# EAGLE design Yugocade (EAGLE 9.6.2)
COMPANY: ADAFRUIT INDUSTRIES; DRAWN: KTOWN; REV: B
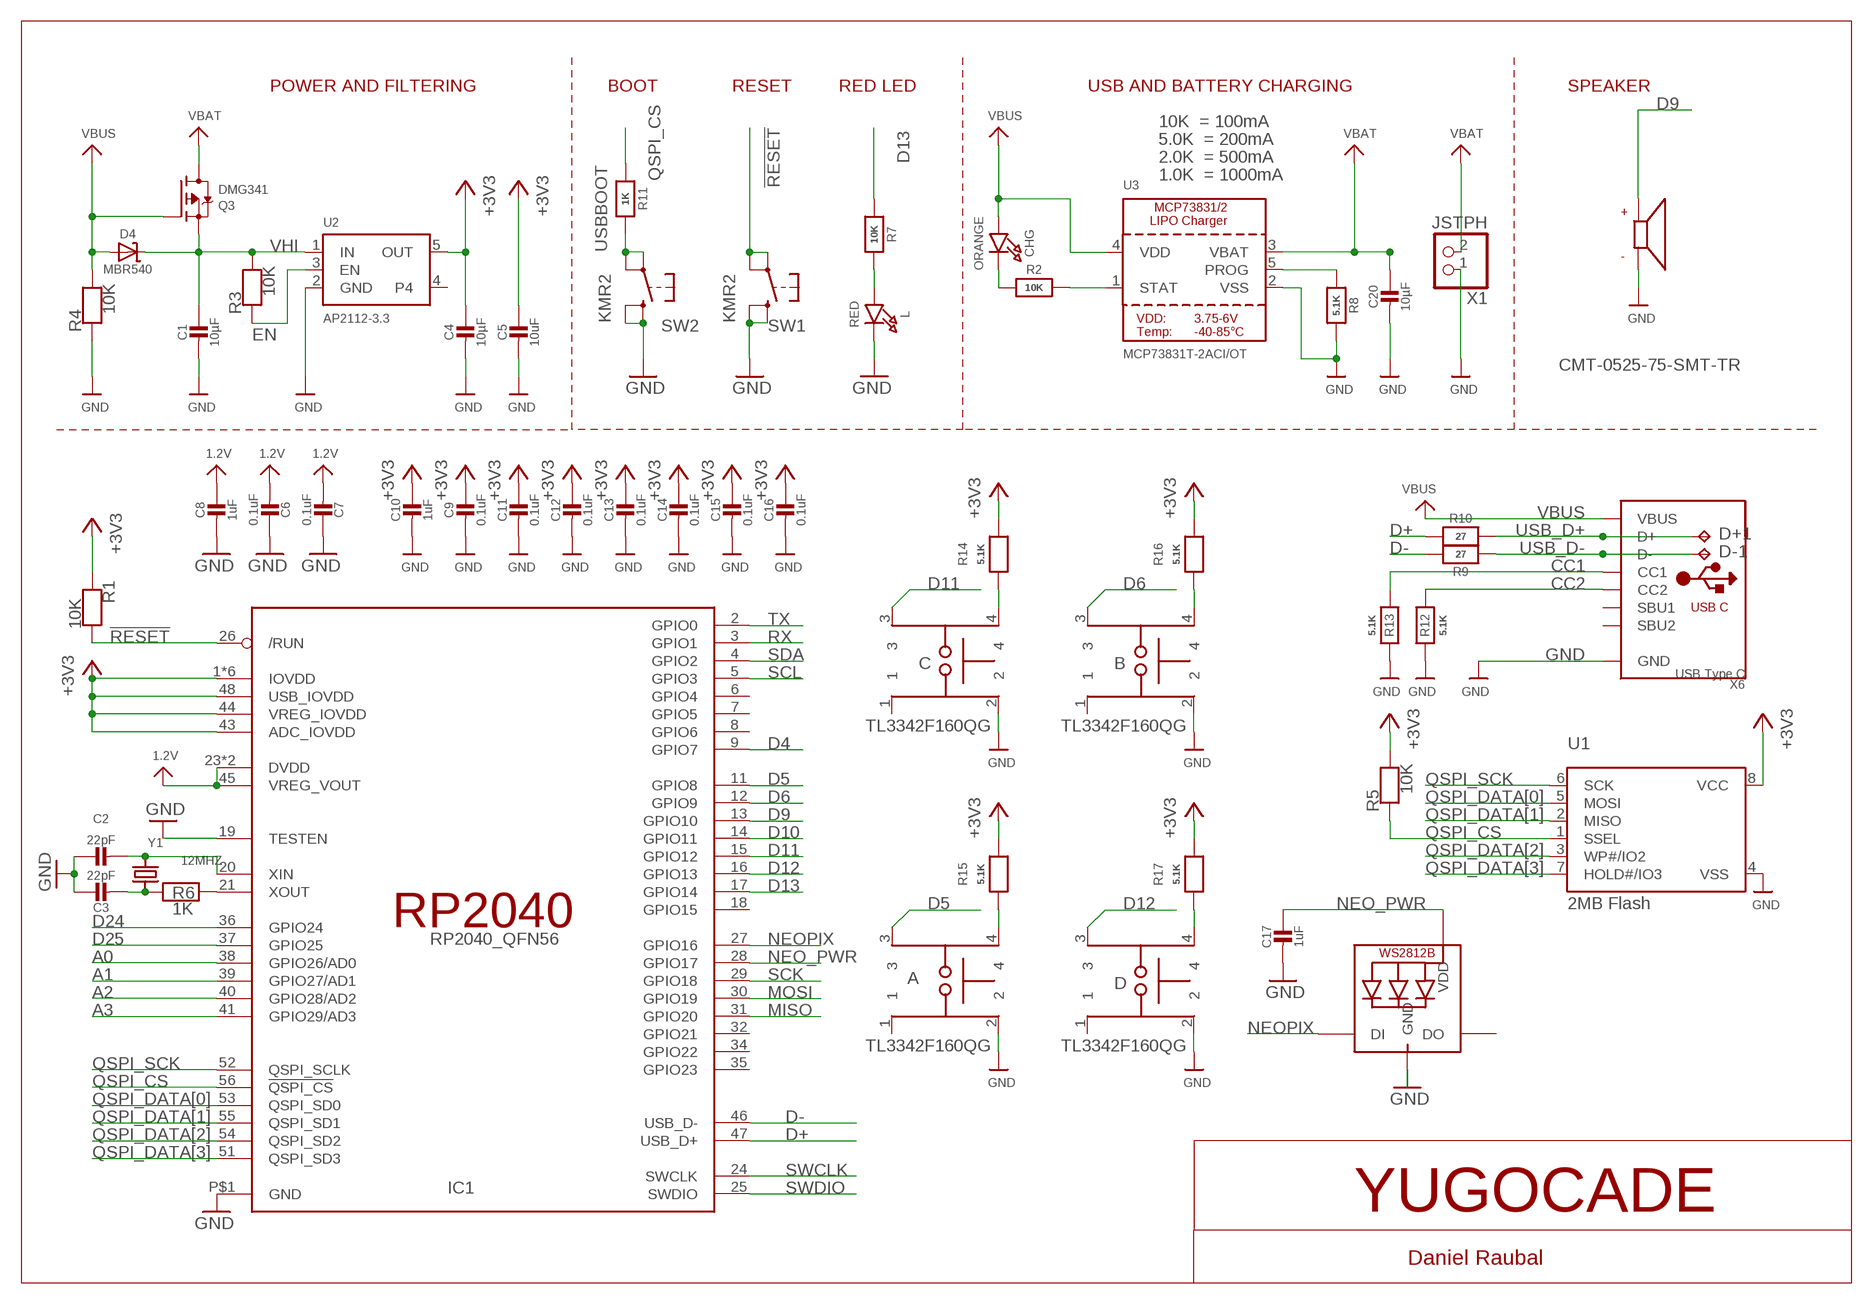
[diagram p0: schematic, sheet 1]

## Parts
A  TL3342F160QG  [SW_TL3342F160QG]
B  TL3342F160QG  [SW_TL3342F160QG]
C  TL3342F160QG  [SW_TL3342F160QG]
C1  10µF  CAP_CERAMIC0805-NOOUTLINE  [0805-NO]
C2  22pF  CAP_CERAMIC0603_NO  [0603-NO]
C3  22pF  CAP_CERAMIC0603_NO  [0603-NO]
C4  10µF  CAP_CERAMIC0805-NOOUTLINE  [0805-NO]
C5  10uF  CAP_CERAMIC0805-NOOUTLINE  [0805-NO]
C6  0.1uF  CAP_CERAMIC0603_NO  [0603-NO]
C7  0.1uF  CAP_CERAMIC0603_NO  [0603-NO]
C8  1uF  CAP_CERAMIC0603_NO  [0603-NO]
C9  0.1uF  CAP_CERAMIC0603_NO  [0603-NO]
C10  1uF  CAP_CERAMIC0603_NO  [0603-NO]
C11  0.1uF  CAP_CERAMIC0603_NO  [0603-NO]
C12  0.1uF  CAP_CERAMIC0603_NO  [0603-NO]
C13  0.1uF  CAP_CERAMIC0603_NO  [0603-NO]
C14  0.1uF  CAP_CERAMIC0603_NO  [0603-NO]
C15  0.1uF  CAP_CERAMIC0603_NO  [0603-NO]
C16  0.1uF  CAP_CERAMIC0603_NO  [0603-NO]
C17  1uF  CAP_CERAMIC0603_NO  [0603-NO]
C20  10µF  CAP_CERAMIC0805-NOOUTLINE  [0805-NO]
CHG  ORANGE  LED0603_NOOUTLINE  [CHIPLED_0603_NOOUTLINE]
D  TL3342F160QG  [SW_TL3342F160QG]
D4  MBR540  DIODE-SCHOTTKYSOD-123  [SOD-123]
D+1  TPB1,27  [B1,27]
D-1  TPB1,27  [B1,27]
IC1  RP2040_QFN56  [QFN56_7MM_REDUCEDEPAD]
L  RED  LED0603_NOOUTLINE  [CHIPLED_0603_NOOUTLINE]
LED1  WS2812B3535  [LED3535]
LS1  CMT-0525-75-SMT-TR  [XDCR_CMT-0525-75-SMT-TR]
Q3  DMG341  MOSFET-P  [SOT23-R]
R1  10K  RESISTOR_0603_NOOUT  [0603-NO]
R2  10K  RESISTOR_0603_NOOUT  [0603-NO]
R3  10K  RESISTOR_0603_NOOUT  [0603-NO]
R4  10K  RESISTOR_0603_NOOUT  [0603-NO]
R5  10K  RESISTOR_0603_NOOUT  [0603-NO]
R6  1K  RESISTOR_0603_NOOUT  [0603-NO]
R7  10K  RESISTOR_0603_NOOUT  [0603-NO]
R8  5.1K  RESISTOR_0603_NOOUT  [0603-NO]
R9  27  RESISTOR_0603_NOOUT  [0603-NO]
R10  27  RESISTOR_0603_NOOUT  [0603-NO]
R11  1K  RESISTOR_0603_NOOUT  [0603-NO]
R12  5.1K  RESISTOR_0603_NOOUT  [0603-NO]
R13  5.1K  RESISTOR_0603_NOOUT  [0603-NO]
R14  5.1K  RESISTOR_0603_NOOUT  [0603-NO]
R15  5.1K  RESISTOR_0603_NOOUT  [0603-NO]
R16  5.1K  RESISTOR_0603_NOOUT  [0603-NO]
R17  5.1K  RESISTOR_0603_NOOUT  [0603-NO]
SW1  KMR2  SWITCH_TACT_SMT4.6X2.8  [BTN_KMR2_4.6X2.8]
SW2  KMR2  SWITCH_TACT_SMT4.6X2.8  [BTN_KMR2_4.6X2.8]
U1  2MB Flash  SPIFLASH_8PIN208MIL  [SOIC8_208MIL]
U2  AP2112-3.3  VREG_SOT23-5  [SOT23-5@1]
U3  MCP73831T-2ACI/OT  MCP73831/2  [SOT23-5]
X1  JSTPH  CON_JST_PH_2PIN_BATT  [JSTPH2_BATT]
X6  USB Type C  USB_C  [USB_C_CUSB31-CFM2AX-01-X]
Y1  12MHZ  CRYSTAL2.5X2.0  [CRYSTAL_2.5X2]

## Nets
1.2V: C6.2 C7.2 C8.1 IC1.23(DVDD) IC1.45(VREG_VOUT) IC1.50(DVDD)
!RESET: IC1.26(/RUN) R1.2 SW1.A'(P1) SW1.A(P)
+3V3: C4.1 C5.1 C9.1 C10.1 C11.1 C12.1 C13.1 C14.1 C15.1 C16.1 IC1.1(IOVDD) IC1.10(IOVDD) IC1.22(IOVDD) IC1.33(IOVDD) IC1.42(IOVDD) IC1.43(ADC_IOVDD) IC1.44(VREG_IOVDD) IC1.48(USB_IOVDD) IC1.49(IOVDD) R1.1 R5.2 R14.1 R15.1 R16.1 R17.1 U1.8(VCC) U2.5(OUT)
A0: IC1.38(GPIO26/AD0)
A1: IC1.39(GPIO27/AD1)
A2: IC1.40(GPIO28/AD2)
A3: IC1.41(GPIO29/AD3)
CC1: R13.2 X6.A5(CC1)
CC2: R12.2 X6.B5(CC2)
D4: IC1.9(GPIO7)
D5: A.3 IC1.11(GPIO8)
D6: B.3 IC1.12(GPIO9)
D9: IC1.13(GPIO10) LS1.P
D10: IC1.14(GPIO11)
D11: C.3 IC1.15(GPIO12)
D12: D.3 IC1.16(GPIO13)
D13: IC1.17(GPIO14) R7.1
D24: IC1.36(GPIO24)
D25: IC1.37(GPIO25)
D+: IC1.47(USB_D+) R10.2
D-: IC1.46(USB_D-) R9.2
EN: R3.1 U2.3(EN)
GND [power]: A.2 B.2 C1.2 C2.1 C3.1 C4.2 C5.2 C6.1 C7.1 C8.2 C9.2 C10.2 C11.2 C12.2 C13.2 C14.2 C15.2 C16.2 C17.2 C20.2 C.2 D.2 IC1.19(TESTEN) IC1.P$1(GND) L.C LED1.4(GND) LS1.N R4.1 R8.2 R12.1 R13.1 SW1.B'(S1) SW1.B(S) SW2.B'(S1) SW2.B(S) U1.4(VSS) U2.2(GND) U3.2(VSS) X1.1 X6.A1B12(GND) X6.B1A12(GND)
MISO: IC1.31(GPIO20)
MOSI: IC1.30(GPIO19)
N$1: CHG.C R2.1
N$2: L.A R7.2
N$3: R2.2 U3.1(STAT)
N$4: R8.1 U3.5(PROG)
N$5: C2.2 IC1.20(XIN) Y1.3
N$6: C3.2 R6.1 Y1.1
N$7: IC1.21(XOUT) R6.2
N$8: C.4 R14.2
N$9: A.4 R15.2
N$10: B.4 R16.2
N$11: D.4 R17.2
NEO_PWR: C17.1 IC1.28(GPIO17) LED1.2(VDD)
NEOPIX: IC1.27(GPIO16) LED1.1(DI)
QSPI_CS: IC1.56(!QSPI_CS) R5.1 R11.1 U1.1(SSEL)
QSPI_DATA[0]: IC1.53(QSPI_SD0) U1.5(MOSI)
QSPI_DATA[1]: IC1.55(QSPI_SD1) U1.2(MISO)
QSPI_DATA[2]: IC1.54(QSPI_SD2) U1.3(WP#/IO2)
QSPI_DATA[3]: IC1.51(QSPI_SD3) U1.7(HOLD#/IO3)
QSPI_SCK: IC1.52(QSPI_SCLK) U1.6(SCK)
RX: IC1.3(GPIO1)
SCK: IC1.29(GPIO18)
SCL: IC1.5(GPIO3)
SDA: IC1.4(GPIO2)
SWCLK: IC1.24(SWCLK)
SWDIO: IC1.25(SWDIO)
TX: IC1.2(GPIO0)
USB_D+: D+1.TP R10.1 X6.A6(D+) X6.B6(D+)
USB_D-: D-1.TP R9.1 X6.A7(D-) X6.B7(D-)
USBBOOT: R11.2 SW2.A'(P1) SW2.A(P)
VBAT [power]: C20.1 Q3.3(D) U3.3(VBAT) X1.2
VBUS [power]: CHG.A D4.A Q3.1(G) R4.2 U3.4(VDD) X6.A4B9(VBUS) X6.B4A9(VBUS)
VHI [power]: C1.1 D4.C Q3.2(S) R3.2 U2.1(IN)
Unconnected: A.1 B.1 C.1 D.1 IC1.6(GPIO4) IC1.7(GPIO5) IC1.8(GPIO6) IC1.18(GPIO15) IC1.32(GPIO21) IC1.34(GPIO22) IC1.35(GPIO23) LED1.3(DO) U2.4 X6.A8(SBU1) X6.B8(SBU2)

## Notes on the sheet
- POWER AND FILTERING | BOOT | RESET | RED LED | USB AND BATTERY CHARGING | SPEAKER
- 10K  = 100mA
- 5.0K  = 200mA
- 2.0K  = 500mA
- 1.0K  = 1000mA
- YUGOCADE
- Daniel Raubal

## Library data of the parts
A B C D = TL3342F160QG:TL3342F160QG: TL3342 Series SPST 1.6 N Round Button Gull Wing Surface Mount Tactile Switch Check availability <https://pricing.snapeda.com/parts/TL3342F160QG/E-Switch/view-part?ref=eda>; AVAILABILITY: In Stock; DESCRIPTION: Tactile Switch SPST-NO Top Actuated Surface Mount; MF: E-Switch; MP: TL3342F160QG; PACKAGE: None; PRICE: None; PURCHASE-URL: https://pricing.snapeda.com/search/part/TL3342F160QG/?ref=eda
C1-C3 C5-C17 C20 = microbuilder:CAP_CERAMIC: Ceramic Capacitors For new designs, use the packages preceded by an '_' character since they are more reliable: The following footprints should be used on most boards: _0402 - Standard footprint for regular board layouts _0603 - Standard footprint for regular board layouts _0805 - Standard footprint for regular board layouts _1206 - Standard footprint for regular board layouts For extremely tight-pitch boards where space is at a premium, the following 'micro-pitch' footprints can be used (smaller pads, no silkscreen outline, etc.): _0402MP - Micro-pitch footprint for very dense/compact boards _0603MP - Micro-pitch footprint for very dense/compact boards _0805MP - Micro-pitch footprint for very dense/compact boards _1206MP - Micro-pitch footprint for very dense/compact boards
C4 = microbuilder:CAP_CERAMIC: Ceramic Capacitors For new designs, use the packages preceded by an '_' character since they are more reliable: The following footprints should be used on most boards: _0402 - Standard footprint for regular board layouts _0603 - Standard footprint for regular board layouts _0805 - Standard footprint for regular board layouts _1206 - Standard footprint for regular board layouts For extremely tight-pitch boards where space is at a premium, the following 'micro-pitch' footprints can be used (smaller pads, no silkscreen outline, etc.): _0402MP - Micro-pitch footprint for very dense/compact boards _0603MP - Micro-pitch footprint for very dense/compact boards _0805MP - Micro-pitch footprint for very dense/compact boards _1206MP - Micro-pitch footprint for very dense/compact boards; REV: A
CHG L = microbuilder:LED: LED 0603 - 0603 Surface Mount Package 2mA: Green LED - Low Power (3.9mcd, 2ma, 1.7Vf) - Digikey: 475-2709-2-ND Orange LED - Low Power (9.8mcd, 2ma, 1.8Vf) - Digikey: 475-1194-2-ND Red LED - Low Power (5mcd, 2ma, 1.8Vf) - Digikey: 475-1195-2-ND Yellow LED - Low Power (7mcd, 2ma, 1.8Vf) - Digikey: 475-1196-2-ND 5mA: Blue LED - Low Power (17mcd, 5ma, 2.9Vf) - Digikey: LNJ937W8CRACT-ND 0805 - 0805 Surface Mount Package 2mA: Red LED (8.8mcd, 2mA, 1.8Vf, Clear) - Low Power [Digikey: 475-2510-1-ND] Green LED (5mcd, 2mA, 1.8Vf, Clear) - Low Power [Digikey: 475-2730-1-ND] Yellow LED (11.3mcd, 2mA, 1.8Vf, Clear) - Low Power [Digikey: 475-2555-1-ND] 20mA: Red LED (104mcd, 20mA, Diffused) - LS R976 [Digikey: 475-1278-6-ND] Red LED (12mcd, 20mA, 2.0Vf, Clear) - APT2012EC [Digikey: 754-1128-1-ND] Green LED (15mcd, 20mA, 2.2Vf, Clear) - APT2012GC [Digikey: 754-1131-1-ND] Orange LED (160mcd, 20mA, 2.1Vf, Clear) - APT2012SECK [Digikey: 754-1130-1-ND] 1206 - 1206 Surface Mount Package Green LED (26mcd, 20mA, Diffused) - LG N971 [Digikey: 475-1407-6-ND] Red LED (15mcd, 20mA, Diffused) - LH N974 [Digikey: 475-1416-6-ND] Cree - Cree High-Power Surface Mount LEDs XPEBWT-L1-0000-00D50 - White 111lm 350mA 2.9Vf 6200K 110° XTEAWT-00-0000-00000LEE3 - White 114lm 350mA 2.85Vf 5000K 115° Everlight - Everlight 45-21 Series Surface Mount LEDs 45-21/QK2C-B2832AC2CB2/2T - Warm White 2000mcd 20mA 3.25Vf 3050K 120° 45-21/LK2C-B38452C4CB2/2T - Nuetral White 2000mcd 20mA 3.25Vf 4150K 120° 45-21/LK2C-B50634C6CB2/2T - Cold White 2200mcd 20mA 3.25Vf 5650K 120° PLCC2 Reverse Mount LS T77K-J1L2-1-0-2-R18-Z - Red 11.25mcd 2mA 1.8Vf 630nm 120° LO T77K-L1M2-24-Z - Orange 19.6mcd 2mA 1.8Vf 606nm 120° LY T77K-K2M1-26-Z - Yellow 15.7mcd 2mA 1.8Vf 587nm 120°
D4 = microbuilder:DIODE-SCHOTTKY
D+1 D-1 = testpad:TP: Test pad
IC1 = adafruit_micro:RP2040
LED1 = microbuilder:WS2812B
LS1 = CMT-0525-75-SMT-TR:CMT-0525-75-SMT-TR: CMT-0525-75-SMT-TR Check availability <https://pricing.snapeda.com/parts/CMT-0525-75-SMT-TR/CUI%20Devices/view-part?ref=eda>; AVAILABILITY: In Stock; CUI_PURCHASE_URL: https://www.cuidevices.com/product/audio/buzzers/audio-transducers/cmt-0525-75-smt-tr?utm_source=snapeda.com&utm_medium=referral&utm_campaign=snapedaBOM; DESCRIPTION: 5 mm, 3 Vo-p, 75 dB, Surface Mount (SMT), Magnetic Audio Transducer Buzzer; MF: CUI Devices; MP: CMT-0525-75-SMT-TR; PACKAGE: CUI Devices; PRICE: None; PURCHASE-URL: https://pricing.snapeda.com/search/part/CMT-0525-75-SMT-TR/?ref=eda
Q3 = microbuilder:MOSFET-P: P-Channel Mosfet LEGEND VDS: Voltage Drain-Source ID: Drain Current RDS(ON): Drain-Source On-State Resistance VGS(TH): Gate-Source Threshold Voltage CISS: Drain-Source Input Capacitance SOT-23 Name VDS ID RDS(ON) VGS(TH) CISS Order Number IRLML5103 30V 760mA 600 mOhm -- 75pF @ 25V Digikey: IRLML5103PBFCT-ND IRLML6401 12V 4.3A 50 mOhm 950mV @ 250µA 830pF @ 10V Digikey: IRLML6401PBFTR-ND NTR0202PL 20V 400mA 800 mOhm 2.3V @ 250uA 70pF @ 5V Digikey: NTR0202PLT1GOSTR-ND NTR4101PT1G 20V 1.8A 85 mOhm 1.2V @ 250uA 675pF @ 10V Digikey: NTR4101PT1GOSCT-ND DMP2004K 20V 600mA 900 mOhm 1V @ 250uA 175pF @ 16V Digikey: DMP2004KDICT-ND PMV65XP 20V 3.9A 76 mOhm 950mV @ 1mA 725pF @ 20V Digikey: 568-2358-2-ND TO-252 Name VDS ID RDS(ON) VGS(TH) CISS Order Number AOD417 30V 25A 34 mOhm 3V @ 250µA 920pF @ 15V Digikey: 785-1106-2-ND PowerPak Name VDS ID RDS(ON) VGS(TH) CISS Order Number AON7401 30V 12A 14 mOhm 3V @ 250µA 2600pF @ 15V Digikey: 785-1302-1-ND
R1-R17 = microbuilder:RESISTOR: Resistors For new designs, use the packages preceded by an '_' character since they are more reliable: The following footprints should be used on most boards: _0402 - Standard footprint for regular board layouts _0603 - Standard footprint for regular board layouts _0805 - Standard footprint for regular board layouts _1206 - Standard footprint for regular board layouts For extremely tight-pitch boards where space is at a premium, the following 'micro-pitch' footprints can be used (smaller pads, no silkscreen outline, etc.): _0402MP - Micro-pitch footprint for very dense/compact boards _0603MP - Micro-pitch footprint for very dense/compact boards _0805MP - Micro-pitch footprint for very dense/compact boards _1206MP - Micro-pitch footprint for very dense/compact boards
SW1 SW2 = microbuilder:SWITCH_TACT_SMT: SMT Tact Switches 6x6mm - Digikey: P12940SCT-ND KMR2 (4.6x2.8mm) - Digikey: 401-1426-1-ND EVQ-PQHB55 - Light Touch, 160GF (4.5x4.5mm) - Digikey: P8090SCT-ND KMT0 - KMT021 NGJ LHS (etc.) IP68/Waterproof - Digikey: CKN10289CT-ND
U1 = microbuilder:SPIFLASH_8PIN: SOIC8 SPI Flash Be careful with the size since SOIC8 flash comes in several 'widths' SOIC8 150 mil M25P16 - 16Mbit (2Mbit x 8) Serial Flash (75MHz SPI Bus), Supply: 2.7-3.6V Digikey: SOIC8 - M25P16-VMN6P-ND SOIC8 208 mil W25Q16BVSSIG - 16Mbit (2Mbit x 8) Serial Flash (104MHz SPI Bus), Supply: 2.7-3.6V Digikey: SOIC8 - W25Q16BVSSIG-ND
U2 = microbuilder:VREG_SOT23-5: SOT23-5 Fixed Voltage Regulators Part Current Out V Out V In V Dropout θJA (°C/W) TJ (°C) Digikey Part No. ADP121 150mA 3.3V 3.4-5.5V 0.09V @ 150mA -- -- ADP121-AUJZ33R7CT-ND ADP121 150mA 3.0V 3.1-5.5V 0.09V @ 150mA -- -- ADP121-AUJZ30R7CT-ND ADP122 300mA 3.3V 3.4-5.5V 0.085V @ 300mA -- -- ADP122AUJZ-3.3-R7CT-ND ADP1712 300mA 3.3V 3.5-5.5V 0.17V @ 300mA -- -- ADP1712AUJZ-3.3-R7TR-ND AP7311 (Low Cost) 150mA 3.3V 3.5-6V 0.15V @ 150mA -- -- AP7311-33WG-7DICT-ND LD39015M18R 150mA 1.8V 1.9V-5.5V 0.08V @ 100mA -- -- 497-6977-1-ND LP2985A-33DBVR 150mA 3.3V 3.3-16V 0.28V @ 150mA 206 150 296-18479-1-ND MCP1824T-3302E/OT 300mA 3.3V 3.5V-6V 0.2V @ 300mA -- -- MCP1824T-3302E/OTCT-ND MIC5205-2.5YM5 TR 150mA 2.5V 2.7-16V 0.165V @ 150mA -- -- 576-1257-2-ND MIC5205-3.0YM5 TR 150mA 3.0V 3.2V-16V 0.165V @ 150mA -- -- 576-1258-2-ND MIC5205-3.3YM5 TR 150mA 3.3V 3.5V-16V 0.165V @ 150mA -- -- 576-1259-2-ND TPS780330220 150mA 3.3V+2.2V 3.6-5.5V 250mV Max -- -- 296-23332-1-ND TDA3663/N1,135 100mA 3.3V 3.5-45V 0.18V @ 50mA -- -- 568-5343-1-ND Max operating temp can be calculated using θJA, TJ (max junction temperature), and power in watts. Set the "Maximum Ambient Temperature" until it reaches TJ ("Max Junction Temperature"), which is the absolute limit for safe use of the regulator: Heat Sink Temperature Calculator <http://www.daycounter.com/Calculators/Heat-Sink-Temperature-Calculator.phtml> For example, With 12V source into a 3.3V LP2985 and a 30mA load, we are dissipating (12V-3.3V) * 0.03A = 0.261W. With a θJA of 206 °C/W, a TJ of 150°C, and 261mW we can safely use the chip without a heat sink up to 75°C (=147.1°C Junction Temperature).
U3 = microbuilder:MCP73831/2: MCP73831/2 LIPO Charger VDD: 3.75 - 6V Temp -40 - 85°C Programmable Charge Rate: 15-500mA NOTE: STAT is a tri-state logic output on the MCP73831 and an open-drain output on the MCP73832. SOT23-5 with 4.2V output and tri-state logic on STAT = MCP73831T-2ACI/OT
X1 = microbuilder:CON_JST_PH_2PIN: JST 2-Pin Right-Angle Connector PH-Series - 4UConnector: 17311 SH-Series - 4UConnector: 07278
X6 = microbuilder:USB_C: USB Type-C USB 2.0 Connector
Y1 = microbuilder:CRYSTAL: Crystals HC49UP - Surface Mount Crystal 4.0MHz 18pF +/-30ppm Surface Mount Crystal [Digikey: 535-9857-1-ND] 12.0 MHz Surface Mount Crystal [Digikey: 535-9869-6-ND] 25.0 MHz Surface Mount Crystal [Digikey: 535-9078-1-ND] 2.5 x 2.0mm - MEMs SMT Crystal 16.0 MHz 10pF 20ppm 2.5 x 2.0mm Crystal [Digikey -40-85°C: 535-10923-1-ND] 3.2 x 2.5mm - MEMs SMT Crystal 12.0 MHz 8pF 15ppm 3.2 x 2.5mm Crystal [Digikey: -10-70°C: 644-1047-1-ND -40-125°C: 644-1128-1-ND] 40~85°C cheaper: 644-1173-6-ND 16.0 MHz 8pF 15ppm 3.2 x 2.5mm Crystal [Digikey: -10-70°C: 644-1049-1-ND -40-125°C: 644-1129-2-ND]-40~85°C cheaper: 644-1175-6-ND 16.0 MHz 10pF 10ppm 3.2 x 2.5mm Crystal [Digikey: 644-1100-1-ND] 27.12 MHz 18pF 30ppm 3.2 x 2.5mm Crystal [Digikey: 887-1424-1-ND] 27.12MHz 10pF 10ppm 3.2 x 2.5mm Crystal [Digikey: 887-1329-1-ND] 4.9 x 1.8mm - MEMs SMT Crystal 32.768 KHz 12.5pF 20ppm 4.9 x 1.8mm Crystal [Digikey: SE2415CT-ND] 8.0 x 3.8mm - Surface Mount Crystal 32.768kHz 12.5pF 20ppm -40°C-85°C [Digikey: 535-9166-2-ND] Cylinder 32.768KHz Cylinder Crystal (2x6mm body) [Ex. Digikey: 300-8341-2-ND]

## Net classes
1 power: width 0.305 mm
2 gnd: width 0.254 mm

## Board
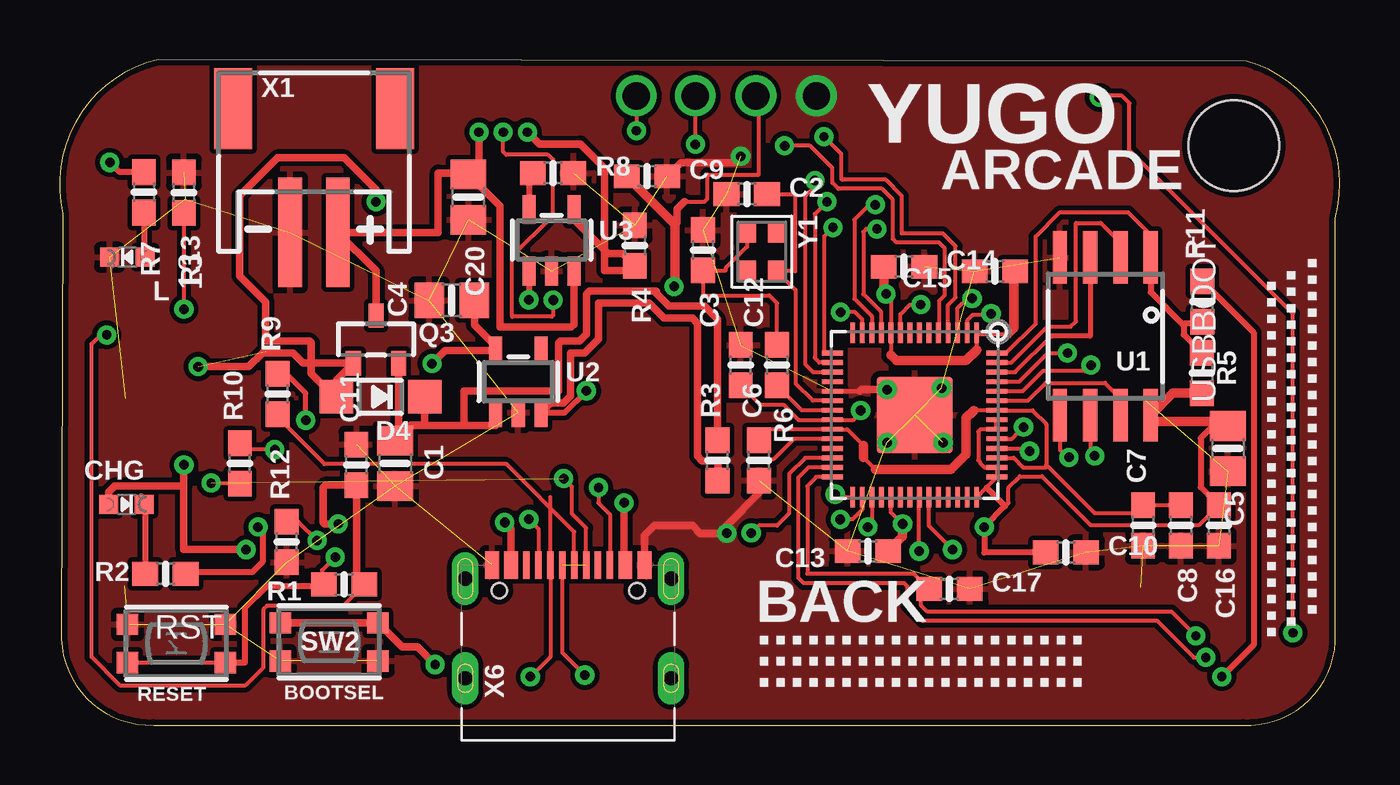
[diagram p1: board, top side]
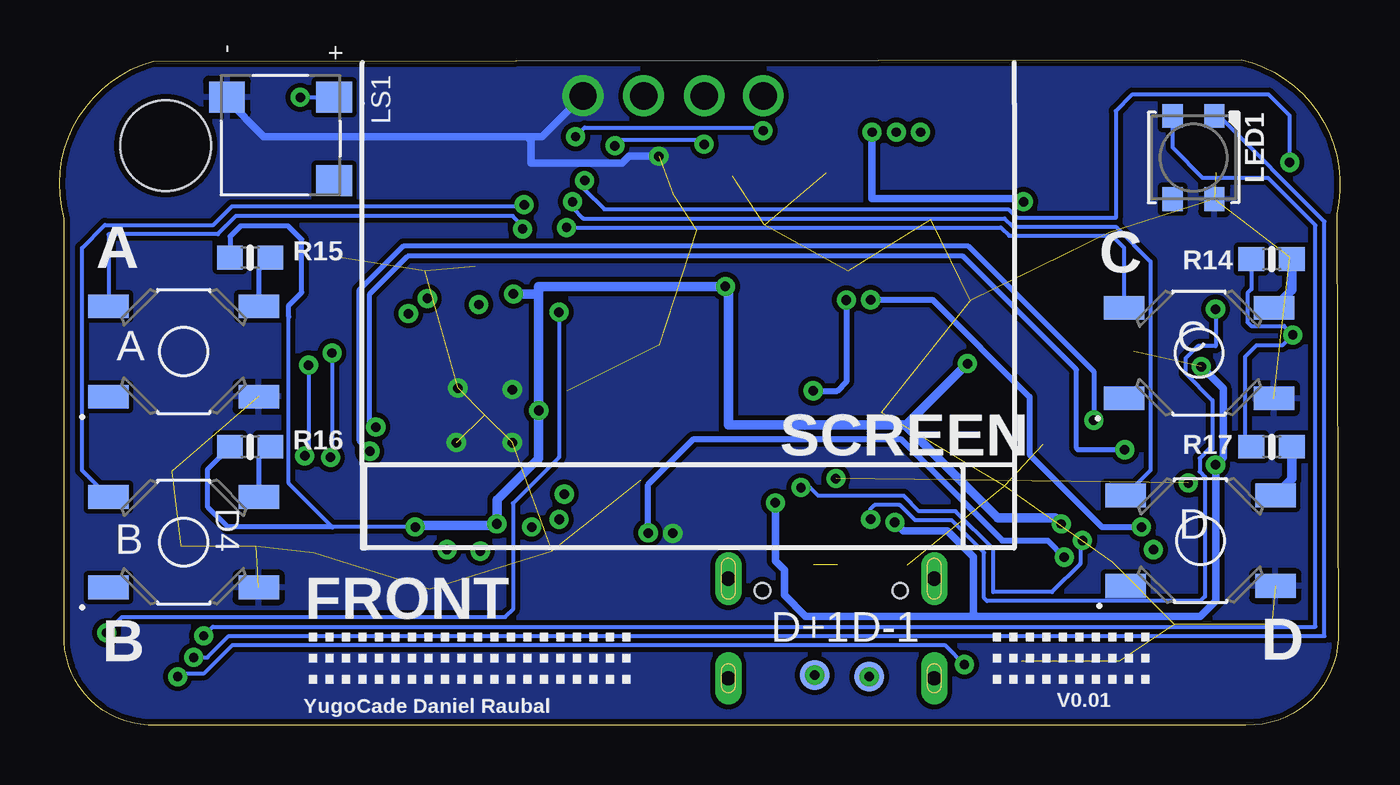
[diagram p2: board, bottom side, seen from below]

Size 53.74 x 27.94 mm. Coordinates in mm from the lower left corner, seen from the top.
Outline: 3.95,0 49.67,0 arc90 53.54,3.49 53.54,21.27 arc90 49.8,27.88 4.14,27.94 arc90 0.14,21.46 0.08,3.62 arc90 3.95,0
Copper layers (1*16): Top 0.035mm / dielectric 1.5mm / Bottom 0.035mm
Design rules "adafruit 7-7 *": minimum track width 7mil, minimum drill 15.5mil, track to track 8mil, track to pad 7mil, pad to pad 7mil, via to via 7mil, smd to smd 7mil, copper to edge 10mil, drill to drill 8mil, minimum pad ring 10mil, minimum via ring 8mil, stop-mask expansion 2mil, vias tented up to drill 20mil, thermal gap 10mil
Holes 3.81 mm at 49.29,24.32

### Footprints (pad centres in the part's own frame; a part is rotated, then mirrored left to right if it is on the bottom)
SW_TL3342F160QG = smd 1.7 x 1: 1 -3.15,-1.9; 2 3.15,-1.9; 3 -3.15,1.9; 4 3.15,1.9
0805-NO = smd 1.24 x 1.5: 1 -0.95,0; 2 0.95,0
0603-NO = smd 1.075 x 1: 1 -0.85,0; 2 0.85,0
CHIPLED_0603_NOOUTLINE = smd 0.8 x 0.8: A 0,-0.75; C 0,0.75
SOD-123 = smd 1.4 x 1.4: A 1.85,0; C -1.85,0
B1,27 = smd 1.27 x 1.27: TP 0,0
QFN56_7MM_REDUCEDEPAD = smd 0.875 x 0.2: 1 -3.45,2.6; 2 -3.45,2.2; 3 -3.45,1.8; 4 -3.45,1.4; 5 -3.45,1; 6 -3.45,0.6; 7 -3.45,0.2; 8 -3.45,-0.2; 9 -3.45,-0.6; 10 -3.45,-1; 11 -3.45,-1.4; 12 -3.45,-1.8; 13 -3.45,-2.2; 14 -3.45,-2.6; 29 3.45,-2.6; 30 3.45,-2.2; 31 3.45,-1.8; 32 3.45,-1.4; 33 3.45,-1; 34 3.45,-0.6; 35 3.45,-0.2; 36 3.45,0.2; 37 3.45,0.6; 38 3.45,1; 39 3.45,1.4; 40 3.45,1.8; 41 3.45,2.2; 42 3.45,2.6 | smd 0.2 x 0.875: 15 -2.6,-3.45; 16 -2.2,-3.45; 17 -1.8,-3.45; 18 -1.4,-3.45; 19 -1,-3.45; 20 -0.6,-3.45; 21 -0.2,-3.45; 22 0.2,-3.45; 23 0.6,-3.45; 24 1,-3.45; 25 1.4,-3.45; 26 1.8,-3.45; 27 2.2,-3.45; 28 2.6,-3.45; 43 2.6,3.45; 44 2.2,3.45; 45 1.8,3.45; 46 1.4,3.45; 47 1,3.45; 48 0.6,3.45; 49 0.2,3.45; 50 -0.2,3.45; 51 -0.6,3.45; 52 -1,3.45; 53 -1.4,3.45; 54 -1.8,3.45; 55 -2.2,3.45; 56 -2.6,3.45 | smd 3.2 x 3.2: P$1 0,0
LED3535 = smd 1 x 0.85: 1 -1.75,0.875; 2 -1.75,-0.875; 3 1.75,-0.875; 4 1.75,0.875
XDCR_CMT-0525-75-SMT-TR = smd 1.3 x 1.5: 1 1.9,2.25; N -1.6,-2.25; P -1.6,2.25
SOT23-R = smd 0.635 x 1.016: 1 -0.95,-1; 2 0.95,-1; 3 0,1
BTN_KMR2_4.6X2.8 = smd 0.9 x 0.9: A 2.05,0.8; A' -2.05,0.8; B 2.05,-0.8; B' -2.05,-0.8
SOIC8_208MIL = smd 0.6 x 2.2: 1 -1.905,-3.315; 2 -0.635,-3.315; 3 0.635,-3.315; 4 1.905,-3.315; 5 1.905,3.315; 6 0.635,3.315; 7 -0.635,3.315; 8 -1.905,3.315
SOT23-5@1 = smd 0.55 x 1.2: 1 -0.95,-1.3; 2 0,-1.3; 3 0.95,-1.3; 4 0.95,1.3; 5 -0.95,1.3
SOT23-5 = smd 0.55 x 1.2: 1 -0.95,-1.3; 2 0,-1.3; 3 0.95,-1.3; 4 0.95,1.3; 5 -0.95,1.3
JSTPH2_BATT = smd 1 x 4.6: 1 -1,-3.7; 2 1,-3.7 | smd 1.6 x 3.4: NC1 -3.4,1.5; NC2 3.4,1.5
USB_C_CUSB31-CFM2AX-01-X = smd 0.575 x 1.15: A1B12 -3.2,3.545; A4B9 -2.4,3.545; B1A12 3.2,3.545; B4A9 2.4,3.545 | smd 0.275 x 1.15: A5 -1.25,3.545; A6 -0.25,3.545; A7 0.25,3.545; A8 1.25,3.545; B5 1.75,3.545; B6 0.75,3.545; B7 -0.75,3.545; B8 -1.75,3.545 | drill 0.6 pad 1 long: M1 -4.32,2.97; M2 4.32,2.97; M3 -4.32,-1.21; M4 4.32,-1.21 | hole 0.65: 2.89,2.47; -2.89,2.47
CRYSTAL_2.5X2 = smd 0.9 x 0.75: 1 -0.825,-0.625; 2 0.825,-0.625; 3 0.825,0.625; 4 -0.825,0.625

### Placement (x,y rotation side)
A  48.53,15.69 0 bottom
B  48.53,7.69 0 bottom
C  5.92,15.62 0 bottom
C1  14.09,10.98 270 top
C2  28.84,22.29 0 top
C3  27,19.94 270 top
C4  16.46,17.83 180 top
C5  49.03,11.61 270 top
C6  29.35,11.11 90 top
C7  45.48,8.38 90 top
C8  47.07,8.38 270 top
C9  24.65,23.04 0 top
C10  42.23,7.25 0 top
C11  12.46,10.92 90 top
C12  28.59,15.11 90 top
C13  33.92,7.3 180 top
C14  35.44,19.24 0 top
C15  39.25,19.05 180 top
C16  48.65,8.38 270 top
C17  37.35,5.72 0 top
C20  17.16,22.16 270 top
CHG  2.81,9.27 270 top
D  5.85,7.75 0 bottom
D4  13.47,13.78 180 top
D+1  22.05,2.1 0 bottom
D-1  19.76,2.03 0 bottom
IC1  35.89,13.02 270 top
L  2.85,19.65 90 top
LED1  6.15,23.83 270 bottom
LS1  44.46,24.77 270 bottom
Q3  13.28,16.19 0 top
R1  11.95,5.91 180 top
R2  4.44,6.35 0 top
R3  27.61,11.11 90 top
R4  24.14,20.13 270 top
R5  47.94,14.78 270 top
R6  30.11,15.11 270 top
R7  3.54,22.37 270 top
R8  20.71,23.18 0 top
R9  9.16,13.91 90 top
R10  7.57,10.99 90 top
R11  47.95,17.78 90 top
R12  9.54,7.69 90 top
R13  5.22,22.35 270 top
R14  2.87,19.56 0 bottom
R15  45.73,19.62 0 bottom
R16  45.73,11.69 0 bottom
R17  2.87,11.69 0 bottom
SW1  4.9,3.43 180 top
SW2  11.31,3.49 0 top
U1  43.89,16.32 180 top
U2  19.25,14.42 0 top
U3  20.65,20.36 0 top
X1  10.68,24.39 0 top
X6  21.35,3.18 0 top
Y1  29.48,19.88 270 top

### Tracks (layer width: path | path; a pad name or v marks a point on that pad's centre or on a via)
1.2V
  Top 0.178: 38.38,13.22 IC1.50 40.83,13.22 41.41,12.64 41.41,10.92 | 33.73,11.24 34.24,10.73 | 33.73,11.75 33.06,12.42 IC1.23 29.8,12.42 C6.2 | 43.43,8.9 43.45,8.92 | 41.41,10.92 41.41,10.83 40.44,10.83 40.04,11.22 IC1.45 | C8.1 C7.2 45.64,9.08 45.47,8.9 43.43,8.9 | 41.41,10.92 43.43,8.9
  Top 0.406: 38.38,13.22 38.05,12.89 38.05,11.37 37.41,10.73 34.24,10.73 | 33.73,11.75 33.73,11.24
!RESET  (via drill 0.4)
  Top 0.178: SW1.A SW1.A' | IC1.26 31.3,11.22 30.62,10.54 30.62,8.89 30.11,8.38 29.35,8.38 v29.03,8.07 | v11.57,7.05 11.02,6.5 11.02,5.83
  Top 0.254: R1.2 11.02,5.83 8.69,5.83 7.78,4.92 7.78,2.63 SW1.A'
  Bottom 0.254: v11.57,7.05 12.27,7.75 14.17,7.75 18.43,12 27.13,12 29.03,10.1 v29.03,8.07
+3V3  (via drill 0.39, 0.4, 1.14)
  Top 0.178: IC1.42 38.9,9.98 IC1.43 IC1.44 38.82,10.82 38.64,11.01 38.64,11.04 38.56,11.11 38.56,12.32 38.65,12.42 IC1.48 | IC1.33 34.89,8.94 v35.38,8.45 | 34.89,15.54 IC1.10 34.89,18.1 v34.68,18.1 | 38.49,15.75 IC1.1 38.55,16.41 39.78,16.41 | v33.62,13.21 33.62,13.12 33.33,12.82 IC1.22 31.02,12.82 30.38,13.46 29.39,13.46 C12.1 28.59,13.88 | C15.1 40.04,19.05 39.86,18.88 | 39.68,9.19 39.83,9.34 39.83,9.97 40.3,10.44 41.23,10.44 43.28,8.39 47.81,8.39 C16.1 | R1.1 11.9,5.01 8.7,5.01 8.55,4.85 8.55,2.42 7.79,1.65 2.55,1.65 1.35,2.86 1.35,16 1.73,16.39 v1.98,16.39 | v29.22,26.42 29.35,26.29 29.35,23.12 27.19,23.12 27.19,22.1 27.06,21.97 26.23,21.97
  Top 0.203: IC1.48 IC1.49
  Top 0.254: 38.9,9.98 39.68,9.19 v38.81,8.32 38.81,7.25 C10.1 | C5.1 48.4,12.56 47.89,12.05 47.89,10 C16.1
  Top 0.305: v15.63,15.18 16.17,15.72 U2.5 18.3,15.91 17.41,16.8 C4.1 | R1.1 12.46,6.25 C11.1 11.16,10.07 11.06,9.97 11.06,8.51 11.12,8.45 v11.7,8.45 | 25.83,21.01 25.92,21.1 25.92,21.66 26.23,21.97
  Top 0.406: 34.89,15.54 35.13,15.31 38.05,15.31 38.49,15.75 | v34.68,18.1 34.6,18.19 C14.1 | 39.78,16.41 40.05,16.67 40.05,18.69 39.86,18.88 | v35.38,8.45 35.38,7.91 C13.1 | 49.1,12.56 C5.1 48.84,12.75 45.73,12.75 45.73,12.94 U1.8 46.72,13.93 R5.2 | C4.1 17.79,17.45 | C9.1 25.83,21.01 25.83,18.46 v25.79,18.42
  Bottom 0.178: 35.38,8.38 v35.38,8.45 | 33.62,18.16 33.67,18.16 | v38.81,8.32 42.29,8.32 44.11,10.14 | 44.11,10.14 44.11,17.15 44.11,17.18 | 44.11,10.14 44.11,10.13 | R14.1 3.72,18.3 3.88,18.13 3.88,16.91 3.73,16.76 2.35,16.76 v1.98,16.39 2.43,15.94 3.5,15.94 3.99,15.46 3.99,11.95 R17.1
  Bottom 0.2: 42.29,8.32 46.68,8.32 47.51,9.15 47.51,10.76 R16.1 | 44.11,17.15 44.11,17.62 43.57,18.16 43.57,20.39 44.14,20.96 46.14,20.96 46.58,20.51 R15.1
  Bottom 0.406: 18.24,12.58 v15.63,15.18 | v38.81,8.32 38.75,8.38 35.38,8.38 | 33.67,18.16 33.73,18.1 v34.68,18.1 | v35.38,8.45 35.38,9.45 33.62,11.2 v33.62,13.21 33.62,18.16 33.62,18.42 v25.79,18.42 25.67,18.29 25.67,12.61 18.27,12.61 18.24,12.58 | 18.24,12.58 14.36,8.7 11.95,8.7 v11.7,8.45
CC1  (via drill 0.4)
  Top 0.178: R13.2 v5.22,17.46 | v19.7,8.64 20.1,8.24 X6.A5
  Bottom 0.178: v5.22,17.46 5.22,15.91 5.97,15.91 6.49,15.39 6.49,14.78 5.35,13.63 5.35,11.59 5.5,11.59 5.89,11.2 5.89,10.65 5.66,10.42 5.66,5.4 5.85,5.21 14.81,5.21 14.93,5.34 14.93,7.25 16.29,8.6 17.82,8.6 18.47,9.24 19.53,9.24 19.7,9.08 v19.7,8.64
CC2  (via drill 0.39)
  Top 0.178: v22.62,9.97 22.62,9.34 23.1,8.86 X6.B5 23.1,6.66 | R12.2 10.02,8.54 v10.81,7.75
  Bottom 0.178: v10.81,7.75 10.9,7.66 10.9,6.77 12.08,5.59 14.55,5.59 14.55,7.41 16.13,8.98 17.67,8.98 18.31,9.63 21.89,9.63 22.24,9.97 v22.62,9.97
D4  (via drill 0.39)
  Top 0.178: IC1.9 35.29,16.64 35.29,17.25 35.7,17.65 v36.14,17.66 | IC1.9
D5  (via drill 0.39)
  Top 0.178: v34.3,20.83 33.86,20.83 33.73,20.71 33.73,18.09 34.49,17.34 34.49,17.33 IC1.11
  Bottom 0.178: v34.3,20.83 34.3,20.96 34.71,21.37 46.34,21.37 47.09,20.61 51.68,20.61 A.3
D6  (via drill 0.39)
  Top 0.178: IC1.12 34.09,17.17 33.35,17.91 33.35,21.21 33.98,21.85 v34.24,21.85
  Bottom 0.178: B.3 52.79,10.7 52.79,20.04 51.83,21 47.29,21 46.5,21.78 34.3,21.78 v34.24,21.85
D9  (via drill 0.39)
  Top 0.178: IC1.13 33.69,17.03 33.38,17.34 v32.78,17.34 | v51.76,3.88 51.76,17.27 44.91,24.13 44.91,26.1 44.59,26.42 43.7,26.42 v43.64,26.35
  Bottom 0.178: v32.78,17.34 32.78,11.24 34.71,9.31 34.71,4.86 35.03,4.54 51.1,4.54 v51.76,3.88 | 42.47,26.37 42.37,26.37 | 42.37,26.37 LS1.P | 42.37,26.37 42.38,26.35 v43.64,26.35 v43.62,26.37
D10
  Top 0.178: IC1.14
D11  (via drill 0.39)
  Top 0.178: IC1.15 32.19,15.62 32.08,15.72 32.08,20.52 v32.46,20.89
  Bottom 0.178: v32.46,20.89 14.23,20.89 13.88,20.54 9.57,20.54 9.07,20.04 C.3
D12  (via drill 0.39)
  Top 0.178: IC1.16 31.89,15.22 31.7,15.42 31.7,21.46 v32.21,21.97
  Bottom 0.178: 7.95,11.31 7.95,19.47 9.41,20.92 13.72,20.92 14.08,21.27 31.76,21.27 32.21,21.72 v32.21,21.97 | 7.95,11.31 | 7.95,11.31 7.95,10.7 D.3
D13  (via drill 0.39, 0.4)
  Top 0.178: IC1.17 31.63,14.82 31.31,15.13 31.31,22.22 31.7,22.61 v31.7,22.86
  Top 0.254: R7.1 2.51,23.22 v2.11,23.62
  Bottom 0.178: v2.11,23.62 2.11,25.59 3,26.48 8.71,26.48 9.41,25.78 9.41,21.3 13.57,21.3 13.92,21.66 30.87,21.66 31.7,22.48 v31.7,22.86
D24  (via drill 0.4)
  Top 0.178: IC1.36 36.06,9.54 36.06,7.28 v36.08,7.3
D25  (via drill 0.4)
  Top 0.178: IC1.37 36.49,8.36 v37.48,7.37
  Bottom 0.178: v37.48,7.37
D+  (via drill 0.4)
  Top 0.178: v9.03,11.56 9.01,11.58 7.82,11.58 R10.2 | IC1.47 39.97,12.02 40.27,12.32 v40.46,12.51
  Bottom 0.203: v40.46,12.51 40.53,12.51 40.72,12.7 40.72,18.1 39.13,19.69 15.82,19.69 11.06,14.92 11.06,11.64 10.99,11.56 v9.03,11.56
D-  (via drill 0.4)
  Top 0.178: v40.72,11.5 40.59,11.62 IC1.46
  Top 0.203: v10.33,12.8 10.33,13.94 9.52,14.76 R9.2
  Bottom 0.203: v40.72,11.5 41.16,11.94 41.16,18.27 39.29,20.13 15.62,20.13 10.33,14.85 v10.33,12.8
EN  (via drill 0.39, 0.4)
  Top 0.178: v20.71,17.85 20.71,17.21 20.65,17.15 19,17.15 19,19.68 20.71,21.39 20.71,23.74 20.51,23.95 18.74,23.95 18.62,24.07 v18.62,24.89
  Top 0.254: 27.23,10.65 R3.1 | 20.27,13.05 U2.3 21.19,13.12 v22.11,14.04
  Top 0.305: 20.27,13.18 U2.3 20.61,13.53 21.15,13.53 21.44,13.83 21.44,15.62 22.02,15.62 22.62,16.22 22.62,17.72 24.74,17.72 25.37,17.08 26.55,17.08 26.78,16.86 26.78,11.29 26.97,11.1 27.63,11.1 27.63,10.29 R3.1
  Bottom 0.254: v20.71,17.85 20.71,14.42 21.09,14.04 v22.11,14.04
GND  (via drill 0.39, 0.4, 1.14)  (40 unrouted)
  Top 0.178: IC1.19 33.58,14.02
  Top 0.305: 33.58,14.02 33.65,14.09 v34.73,14.09 35.8,13.02 IC1.P$1 | C6.1 29.35,9.74 28,8.39 v28,8.05 26.89,8.05 26.55,8.38 24.97,8.38 24.55,7.96 X6.B1A12 | C9.2 26.08,23.62 28.33,23.62 v28.59,23.88
  Bottom 0.305: 34.11,24.7 45.16,24.7 46.71,26.26 LS1.N | 34.11,24.7 33.48,24.7 v31.76,26.42 | v28.59,23.88 29.84,23.88 30.13,23.59 33.95,23.59 33.95,24.54 34.11,24.7
  other vias: 37.02,14.15 37.08,11.86 34.73,11.86
  pour Top: 0.01,27.94 0.01,0 53.73,-0.07 53.73,27.94
  pour Bottom: 53.61,0 0.08,0 0.08,27.94 53.61,27.94
MISO  (via drill 0.4)
  Top 0.178: IC1.31 34.09,8.49 v33.92,8.32
MOSI  (via drill 0.4)
  Top 0.178: IC1.30 33.69,9.05 33.28,8.64 v32.77,8.64
N$1
  Top 0.254: CHG.C 3.59,9.23 R2.1
N$2
  Top 0.254: R7.2 3.54,19.7 L.A
N$3  (via drill 0.4)
  Top 0.254: v8.33,8.32 8.52,8.13 8.52,6.85 8.09,6.42 5.36,6.42 R2.2 | U3.1 v19.7,17.86
  Bottom 0.254: v8.33,8.32 9.98,8.32 13.03,11.37 13.03,13.78 17.11,17.86 v19.7,17.86
N$4
  Top 0.254: R8.1 19.7,23.02 U3.5
N$5
  Top 0.178: C2.2 30.87,22.29 30.87,19.05 Y1.3 30.89,18.27 30.89,14.35 31.61,13.62 IC1.20
N$6
  Top 0.178: Y1.1 28.85,20.08 27.95,19.19 27.95,19.09 C3.2 27,18.04 29.79,18.04 30.11,17.72 R6.1
N$7
  Top 0.178: IC1.21 31.16,13.22 R6.2
N$8
  Bottom 0.406: C.4 2.02,18.27 R14.2
N$9
  Bottom 0.2: R15.2 45.38,19.13 A.4
N$10
  Bottom 0.2: R16.2 45.38,11.19 B.4
N$11
  Bottom 0.406: D.4 2.02,10.33 R17.2
NEO_PWR  (via drill 0.39)
  Top 0.178: IC1.28 31.76,10.42 31.38,10.04 31.38,6.35 35.86,6.35 C17.1 36.16,5.38 36.16,5.03 36.43,4.76 46.67,4.76 v47.69,3.75
  Bottom 0.178: v47.69,3.75 47.31,4.13 1.03,4.13 1.03,20.99 3.01,22.97 5.75,22.97 7.02,24.24 LED1.2
NEOPIX  (via drill 0.39)
  Top 0.178: IC1.27 32.42,10.84 31.45,10.84 31,10.38 31,6.19 31.22,5.97 35.44,5.97 35.57,5.84 35.57,5.02 36.22,4.37 46.07,4.37 47.6,2.84 v48.11,2.84
  Bottom 0.178: v48.11,2.84 47.53,2.84 46.63,3.75 0.65,3.75 0.65,21.15 5.08,25.58 LED1.1
QSPI_CS
  Top 0.178: IC1.56 39.72,15.62 40.97,16.87 40.97,20.51 41.99,21.53 44.84,21.53 45.8,20.58 U1.1 45.8,18.54
  Top 0.254: R5.1 47.18,16.4 47.18,16.86 | 47.18,16.86 47.15,16.82 45.8,18.18 45.8,18.54 | R11.1 47.89,16.87 47.18,16.86
QSPI_DATA[0]  (via drill 0.39)
  Top 0.178: IC1.53 40.27,14.42 41.48,15.62 v42.3,15.62 | v42.37,11.24 42.29,11.24 41.99,11.55 U1.5
  Bottom 0.178: v42.3,15.62 42.3,11.31 v42.37,11.24
QSPI_DATA[1]
  Top 0.178: 44.53,20.26 43.7,21.08 42.65,21.08 42.65,16.95 42.43,16.73 41.45,16.73 39.95,15.22 IC1.55
  Top 0.203: 44.53,20.26 U1.2
QSPI_DATA[2]
  Top 0.178: IC1.54 40.1,14.82 41.62,16.33
  Top 0.203: U1.3 43.26,16.33 41.62,16.33
QSPI_DATA[3]
  Top 0.178: IC1.51 40.63,13.62 41.38,14.37 43.87,14.37 44.53,13.72 U1.7
QSPI_SCK  (via drill 0.39)
  Top 0.178: IC1.52 40.43,14.02 41.27,14.86 43.03,14.86 v43.29,15.11 | v43.45,11.31 43.26,11.5 U1.6
  Bottom 0.178: v43.29,15.11 43.29,11.46 v43.45,11.31
RX  (via drill 0.4)
  Top 0.178: v38.3,17.91 38.09,17.91 37.67,17.48 37.67,16.49 IC1.3
SCK  (via drill 0.4)
  Top 0.178: IC1.29 32.68,9.57 v32.55,9.7
SCL  (via drill 0.39, 1.14)
  Top 0.178: IC1.5 36.91,16.49 36.91,17.8 37.16,18.05 37.16,20.01 36.91,20.26 35.13,20.26 34.97,20.42 34.97,22.06 34.51,22.51 32.68,22.51 32.43,22.77 32.43,23.39 31.5,24.32 v30.43,24.32 | v26.68,24.39 v26.68,26.42
  Bottom 0.178: v30.43,24.32 30.17,24.58 26.87,24.58 v26.68,24.39
SDA  (via drill 0.39, 1.14)
  Top 0.178: IC1.4 37.29,17.64 37.6,17.95 37.6,20.1 37.06,20.64 35.35,20.64 35.35,22.22 34.67,22.89 32.84,22.89 32.81,22.92 32.81,23.97 v32.08,24.7 | v24.21,26.42 v24.21,24.96
  Bottom 0.178: v32.08,24.7 31.7,25.08 24.33,25.08 v24.21,24.96
SWCLK
  Top 0.178: 29.35,11.11 29.39,11.16 29.96,11.16 30.82,12.02 IC1.24
TX  (via drill 0.4)
  Top 0.178: IC1.2 38.11,16.49 38.11,17 38.32,17.21 39.03,17.21 v39.09,17.27
USB_D+  (via drill 0.39, 0.4)  (2 unrouted)
  Top 0.178: D+1.TP 21.1,3.05 X6.A6 | v21.16,10.35 21.5,10.01 21.5,8.87 22.1,8.27 X6.B6 | R10.1 6.39,10.14 v6.36,10.16
  other vias: 22.05,2.1
USB_D-  (via drill 0.4)
  Top 0.178: 20.6,9.56 X6.B7 20.6,2.87 D-1.TP | R9.1 9.16,12.93 11.12,10.96 18.75,10.96 21.6,8.12 X6.A7
  other vias: 19.76,2.03
USBBOOT  (via drill 0.39)
  Top 0.254: R11.2 50.11,16.47 50.11,3.37 v48.78,2.03
  Top 0.305: SW2.A' SW2.A 14.37,3.29 15.02,3.29 v15.76,2.54
  Bottom 0.178: v15.76,2.54 16.59,3.37 46.47,3.37 47.66,2.18 48.64,2.18 v48.78,2.03
VBAT  (via drill 0.39)
  Top 0.305: Q3.3 13.28,19.08 X1.2 15.89,20.69 15.89,23.18 17.09,23.18 | 17.09,23.18 C20.1 18.49,21.78 18.49,16.7 21.48,16.7 21.6,16.83 U3.3 | 17.09,23.18 17.6,23.18 v17.6,24.89
VBUS  (via drill 0.39, 0.4)  (1 unrouted)
  Top 0.305: 5.22,10.03 5.22,7.37 v7.82,7.37 | 5.22,10.03 v5.22,10.92 | 5.22,10.03 2.31,10.03 2.06,9.78 CHG.A | U3.4 21.6,21.22 23.03,19.79 23.63,19.79 R4.2 23.95,19.09 22.87,19.09 22.87,23.37 21.86,24.39 20.14,24.39 v19.63,24.89 | 8.66,15.69 8.65,15.67 | v13.28,21.97 13.28,22.48 11.95,23.81 9.16,23.81 7.57,22.23 7.57,18.86 8.66,17.77 8.66,16.12 10.51,16.12 10.56,16.06 10.56,14.76 11.53,13.79 11.53,13.78 D4.A 11.62,14.49 Q3.1 10.22,15.19 9.79,15.63 8.52,15.63 7.95,15.05 v5.82,15.05 | v23.7,9.34 23.7,6.77 X6.B4A9 | X6.A4B9 18.95,8.24 v18.68,8.51
  Bottom 0.305: v5.82,15.05 4.9,14.14 4.9,11.24 v5.22,10.92 5.22,5.21 5.85,4.57 15.38,4.57 | v13.28,21.97 13.41,22.1 19.63,22.1 v19.63,24.89 | 15.38,4.57 22.43,4.57 23.32,5.46 23.32,6.52 23.7,6.9 v23.7,9.34 | v18.68,8.51 18.33,8.16 16.47,8.16 15.38,7.06 15.38,4.57
VHI
  Top 0.305: C1.1 14.23,11.93 Q3.2 | D4.C 15.32,12.61 14.76,12.61 C1.1 | 16.97,12.58 14.73,12.58 C1.1 | 16.97,12.58 18.3,12.58 U2.1 | 16.97,12.58 16.97,14.04 20.93,14.04 20.93,16.04 21.03,16.13 21.81,16.13 22.11,16.43 22.11,18.1 22.24,18.23 25.03,18.23 25.06,18.2 25.06,18.11 25.58,17.59 27.06,17.59 27.61,17.05 R3.2

### Text on the board
tPlace: 13 | USBBOOT | RST
bPlace: D4
tNames: YUGO | ARCADE | BACK | ...................... | .................... | ...................... | ...................... | .................... | .................... | RESET | BOOTSEL
bNames: A | C | SCREEN | FRONT | .......... | .................... | D | .......... | .................... | B | .......... | .................... | V0.01 | YugoCade Daniel Raubal